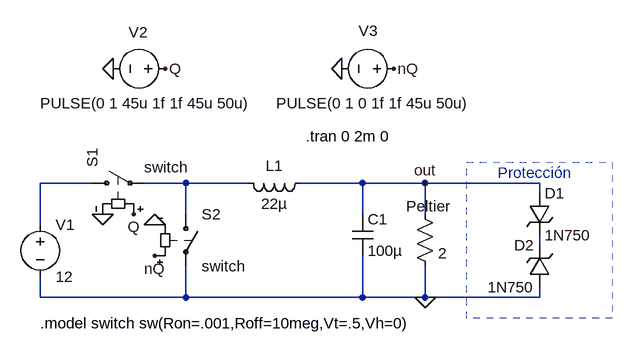
[diagram p0: schematic Proteccion.asc]
Proteccion.asc, the LTspice schematic file:
Version 4
SHEET 1 908 680
WIRE 32 96 -48 96
WIRE 176 96 112 96
WIRE 272 96 176 96
WIRE 448 96 352 96
WIRE 544 96 448 96
WIRE 720 96 544 96
WIRE 720 112 720 96
WIRE 176 144 176 96
WIRE 448 144 448 96
WIRE 544 144 544 96
WIRE -48 160 -48 96
WIRE 720 192 720 176
WIRE -48 272 -48 240
WIRE 176 272 176 224
WIRE 176 272 -48 272
WIRE 448 272 448 208
WIRE 448 272 176 272
WIRE 544 272 544 224
WIRE 544 272 448 272
WIRE 720 272 720 256
WIRE 720 272 544 272
FLAG 544 272 0
FLAG 48 144 0
FLAG 128 160 0
FLAG 64 -80 0
FLAG 416 -80 0
FLAG 144 -80 Q
FLAG 496 -80 nQ
FLAG 544 96 out
FLAG 96 144 Q
FLAG 128 208 nQ
SYMBOL cap 432 144 R0
SYMATTR InstName C1
SYMATTR Value 100µ
SYMBOL ind 368 80 R90
WINDOW 0 5 56 VBottom 2
WINDOW 3 32 56 VTop 2
SYMATTR InstName L1
SYMATTR Value 22µ
SYMBOL sw 16 96 R270
WINDOW 3 24 96 VRight 2
SYMATTR InstName S1
SYMATTR Value switch
SYMBOL sw 176 128 R0
SYMATTR InstName S2
SYMATTR Value switch
SYMBOL res 528 128 R0
WINDOW 0 -13 4 Left 2
SYMATTR InstName Peltier
SYMATTR Value 2
SYMBOL voltage -48 144 R0
SYMATTR InstName V1
SYMATTR Value 12
SYMBOL voltage 160 -80 R90
WINDOW 0 -56 43 VRight 2
WINDOW 3 53 -116 VRight 2
WINDOW 123 0 0 Left 2
WINDOW 39 0 0 Left 2
SYMATTR InstName V2
SYMATTR Value PULSE(0 1 45u 1f 1f 45u 50u)
SYMBOL voltage 512 -80 R90
WINDOW 0 -58 41 VRight 2
WINDOW 3 53 -100 VRight 2
WINDOW 123 0 0 Left 2
WINDOW 39 0 0 Left 2
SYMATTR InstName V3
SYMATTR Value PULSE(0 1 0 1f 1f 45u 50u)
SYMBOL zener 704 112 R0
SYMATTR InstName D1
SYMATTR Value 1N750
SYMBOL zener 736 256 R180
WINDOW 0 24 64 Left 2
WINDOW 3 24 0 Left 2
SYMATTR InstName D2
SYMATTR Value 1N750
TEXT 360 24 Left 2 !.tran 0 2m 0
TEXT -48 312 Left 2 !.model switch sw(Ron=.001,Roff=10meg,Vt=.5,Vh=0)
TEXT 656 80 Left 2 ;Protección
RECTANGLE Normal 832 304 608 64 2

The netlist it stands for:
* Proteccion.asc
C1 out 0 100µ
L1 out N002 22µ
S1 N001 N002 Q 0 switch
S2 N002 0 nQ 0 switch
R§Peltier out 0 2
V1 N001 0 12
V2 Q 0 PULSE(0 1 45u 1f 1f 45u 50u)
V3 nQ 0 PULSE(0 1 0 1f 1f 45u 50u)
D1 out N003 1N750
D2 0 N003 1N750
.model D D
.lib standard.dio
.tran 0 2m 0
.model switch sw(Ron=.001,Roff=10meg,Vt=.5,Vh=0)
* Protección
.backanno
.end